# EAGLE design AgnusAdaptorv2 (EAGLE 9.6.2)
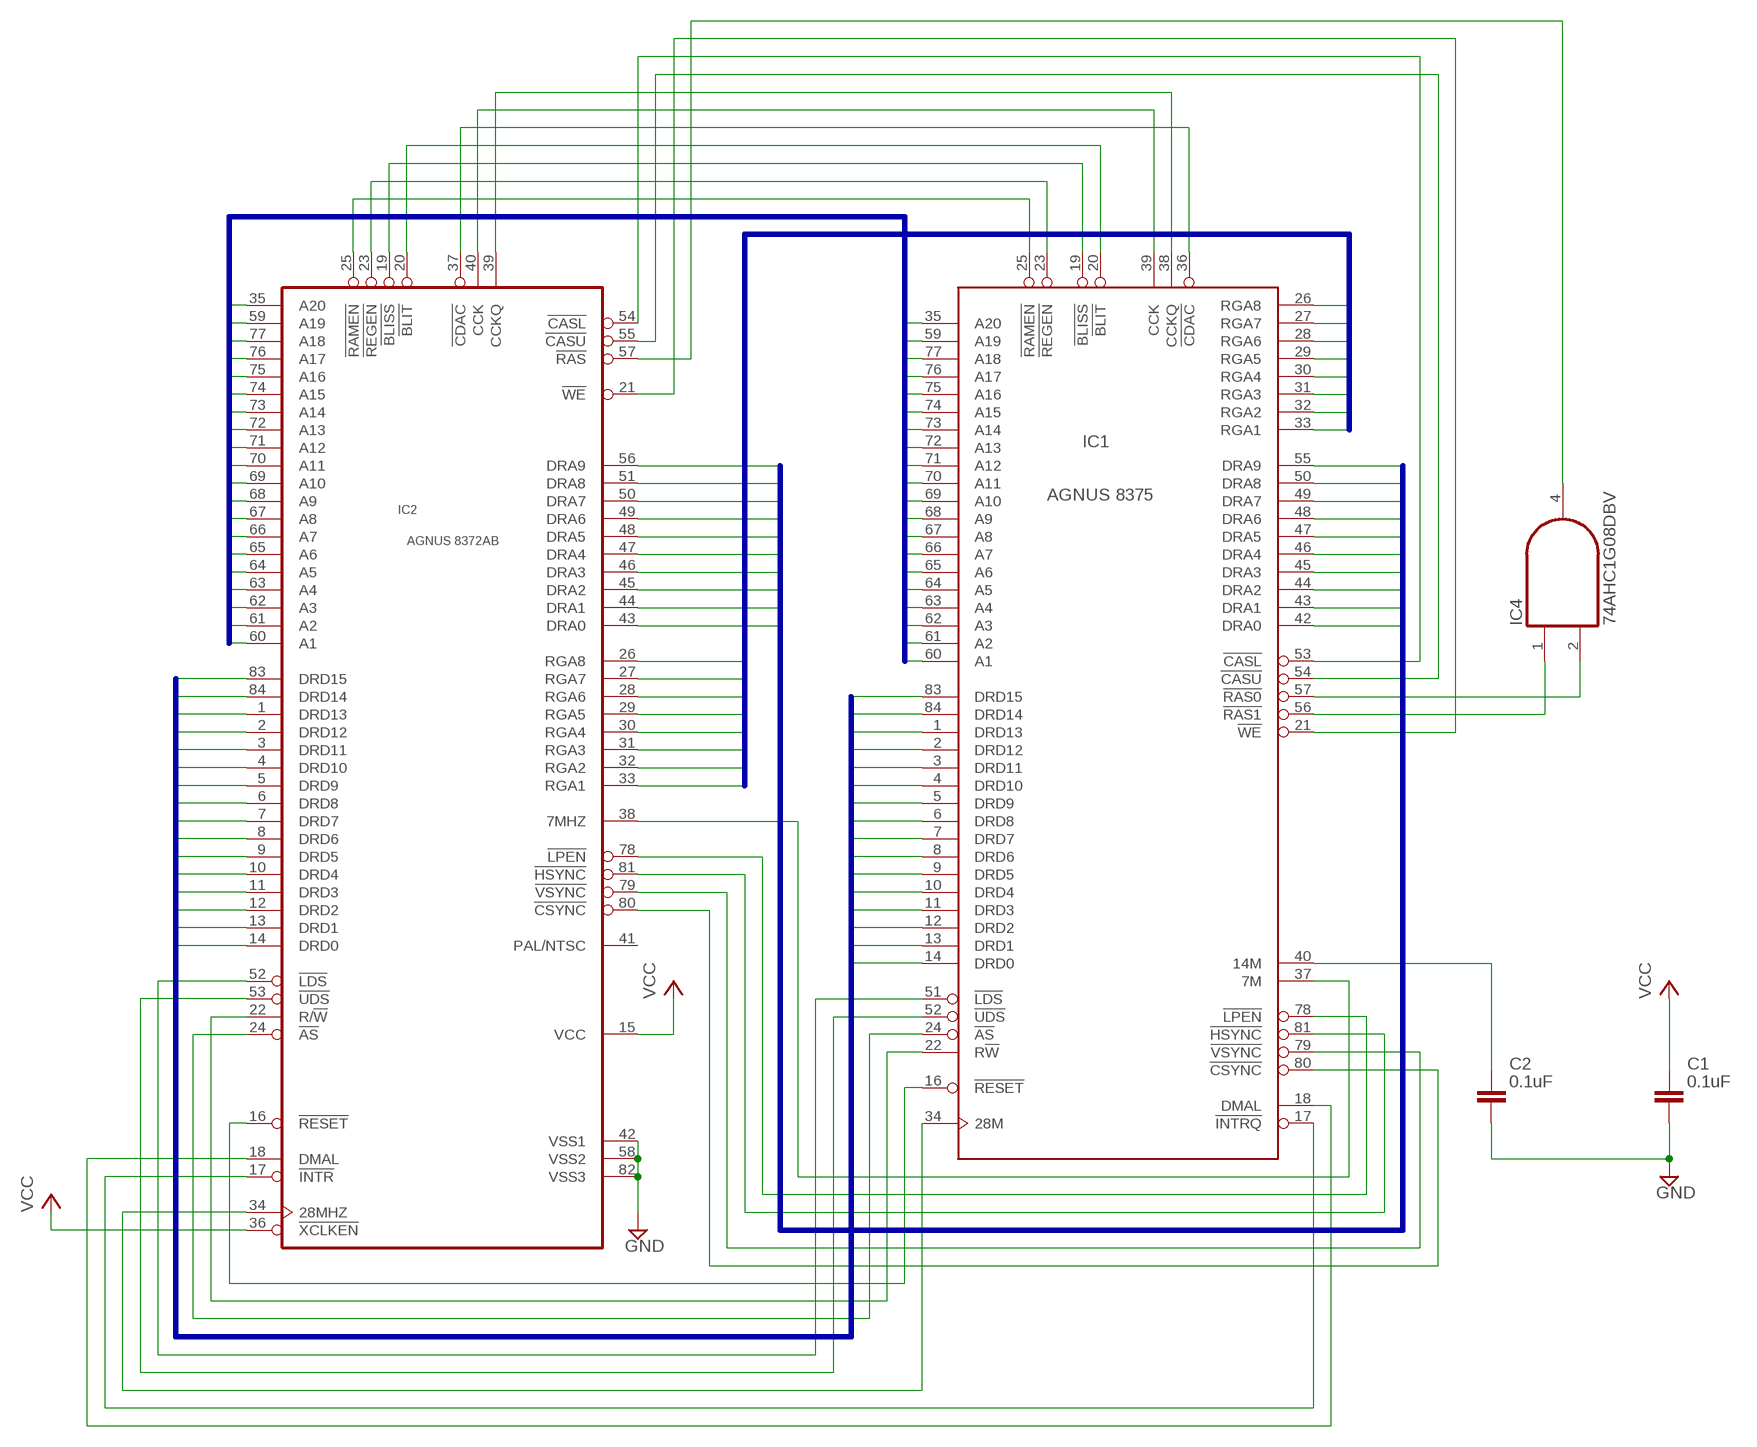
[diagram p0: schematic, sheet 1]

## Parts
C1  0.1uF  C_CHIP-0805(2012-METRIC)  [CAPC2012X110]
C2  0.1uF  C_CHIP-0805(2012-METRIC)  [CAPC2012X110]
IC1  AGNUS_8375_A500+_A600_THT  [PLCC84_T]
IC2  A3000 Agnus Socket  AGNUS_8372AB_THT_HDR  [PLCC84_T_H]
IC4  74AHC1G08DBV  [SOT23-5]

## Nets
7MHZ: IC1.37(7M) IC2.38(7MHZ)
28MHZ: IC1.34(28M) IC2.34(28MHZ)
!AS: IC1.24(!AS) IC2.24(!AS)
!BLISS: IC1.19(!BLISS) IC2.19(!BLISS)
!BLIT: IC1.20(!BLIT) IC2.20(!BLIT)
!CASL: IC1.53(!CASL) IC2.54(!CASL)
!CASU: IC1.54(!CASU) IC2.55(!CASU)
!CDAC: IC1.36(!CDAC) IC2.37(!CDAC)
!CSYNC: IC1.80(!CSYNC) IC2.80(!CSYNC)
!HSYNC: IC1.81(!HSYNC) IC2.81(!HSYNC)
!INTRQ: IC1.17(!INTRQ) IC2.17(!INTR)
!LDS: IC1.51(!LDS) IC2.52(!LDS)
!LPEN: IC1.78(!LPEN) IC2.78(!LPEN)
!RAMEN: IC1.25(!RAMEN) IC2.25(!RAMEN)
!RAS: IC2.57(!RAS) IC4.4(O)
!RAS0: IC1.57(!RAS0) IC4.2(I1)
!RAS1: IC1.56(!RAS1) IC4.1(I0)
!REGEN: IC1.23(!REGEN) IC2.23(!REGEN)
!RESET: IC1.16(!RESET) IC2.16(!RESET)
!UDS: IC1.52(!UDS) IC2.53(!UDS)
!VSYNC: IC1.79(!VSYNC) IC2.79(!VSYNC)
!WE: IC1.21(!WE) IC2.21(!WE)
A1: IC1.60(A1) IC2.60(A1)
A2: IC1.61(A2) IC2.61(A2)
A3: IC1.62(A3) IC2.62(A3)
A4: IC1.63(A4) IC2.63(A4)
A5: IC1.64(A5) IC2.64(A5)
A6: IC1.65(A6) IC2.65(A6)
A7: IC1.66(A7) IC2.66(A7)
A8: IC1.67(A8) IC2.67(A8)
A9: IC1.68(A9) IC2.68(A9)
A10: IC1.69(A10) IC2.69(A10)
A11: IC1.70(A11) IC2.70(A11)
A12: IC1.71(A12) IC2.71(A12)
A13: IC1.72(A13) IC2.72(A13)
A14: IC1.73(A14) IC2.73(A14)
A15: IC1.74(A15) IC2.74(A15)
A16: IC1.75(A16) IC2.75(A16)
A17: IC1.76(A17) IC2.76(A17)
A18: IC1.77(A18) IC2.77(A18)
A19: IC1.59(A19) IC2.59(A19)
A20: IC1.35(A20) IC2.35(A20)
CCK: IC1.39(CCK) IC2.40(CCK)
CCKQ: IC1.38(CCKQ) IC2.39(CCKQ)
DMAL: IC1.18(DMAL) IC2.18(DMAL)
DRA0: IC1.42(DRA0) IC2.43(DRA0)
DRA1: IC1.43(DRA1) IC2.44(DRA1)
DRA2: IC1.44(DRA2) IC2.45(DRA2)
DRA3: IC1.45(DRA3) IC2.46(DRA3)
DRA4: IC1.46(DRA4) IC2.47(DRA4)
DRA5: IC1.47(DRA5) IC2.48(DRA5)
DRA6: IC1.48(DRA6) IC2.49(DRA6)
DRA7: IC1.49(DRA7) IC2.50(DRA7)
DRA8: IC1.50(DRA8) IC2.51(DRA8)
DRA9: IC1.55(DRA9) IC2.56(DRA9)
DRD0: IC1.14(DRD0) IC2.14(DRD0)
DRD1: IC1.13(DRD1) IC2.13(DRD1)
DRD2: IC1.12(DRD2) IC2.12(DRD2)
DRD3: IC1.11(DRD3) IC2.11(DRD3)
DRD4: IC1.10(DRD4) IC2.10(DRD4)
DRD5: IC1.9(DRD5) IC2.9(DRD5)
DRD6: IC1.8(DRD6) IC2.8(DRD6)
DRD7: IC1.7(DRD7) IC2.7(DRD7)
DRD8: IC1.6(DRD8) IC2.6(DRD8)
DRD9: IC1.5(DRD9) IC2.5(DRD9)
DRD10: IC1.4(DRD10) IC2.4(DRD10)
DRD11: IC1.3(DRD11) IC2.3(DRD11)
DRD12: IC1.2(DRD12) IC2.2(DRD12)
DRD13: IC1.1(DRD13) IC2.1(DRD13)
DRD14: IC1.84(DRD14) IC2.84(DRD14)
DRD15: IC1.83(DRD15) IC2.83(DRD15)
GND: C1.2 C2.2 IC2.42(VSS1) IC2.58(VSS2) IC2.82(VSS3)
N$1: C2.1 IC1.40(14M)
R!W: IC1.22(R!W) IC2.22(R/!W!)
RGA1: IC1.33(RGA1) IC2.33(RGA1)
RGA2: IC1.32(RGA2) IC2.32(RGA2)
RGA3: IC1.31(RGA3) IC2.31(RGA3)
RGA4: IC1.30(RGA4) IC2.30(RGA4)
RGA5: IC1.29(RGA5) IC2.29(RGA5)
RGA6: IC1.28(RGA6) IC2.28(RGA6)
RGA7: IC1.27(RGA7) IC2.27(RGA7)
RGA8: IC1.26(RGA8) IC2.26(RGA8)
VCC [Vcc]: C1.1 IC2.15(VCC) IC2.36(!XCLKEN)
Unconnected: IC2.41(PAL/NTSC)

## Buses
A[1..20]
DRD[0..15]
RGA[1..8]
DRA[0..9]

## Power pins joined to a net without a drawn wire
GND: IC1.41(GND) IC1.58(GND) IC1.82(GND) IC4.3(GND)
VCC: IC1.15(VCC) IC4.5(VCC)

## Library data of the parts
C1 C2 = Capacitor:C: Capacitor - Generic; CATEGORY: Capacitor
IC1 = Amiga:AGNUS_8375_A500+_A600: 8375-(390344-0X)-AGNUS for A500+ and A600; SPICEPREFIX: X
IC2 = Amiga:AGNUS_8372AB: 8372AB AGNUS (318069-03x) for A3000(T)
IC4 = 74xx-little-us:74*1G08: 2-input AND gate

## Net classes
1 Vcc: width 0.406 mm

## Board
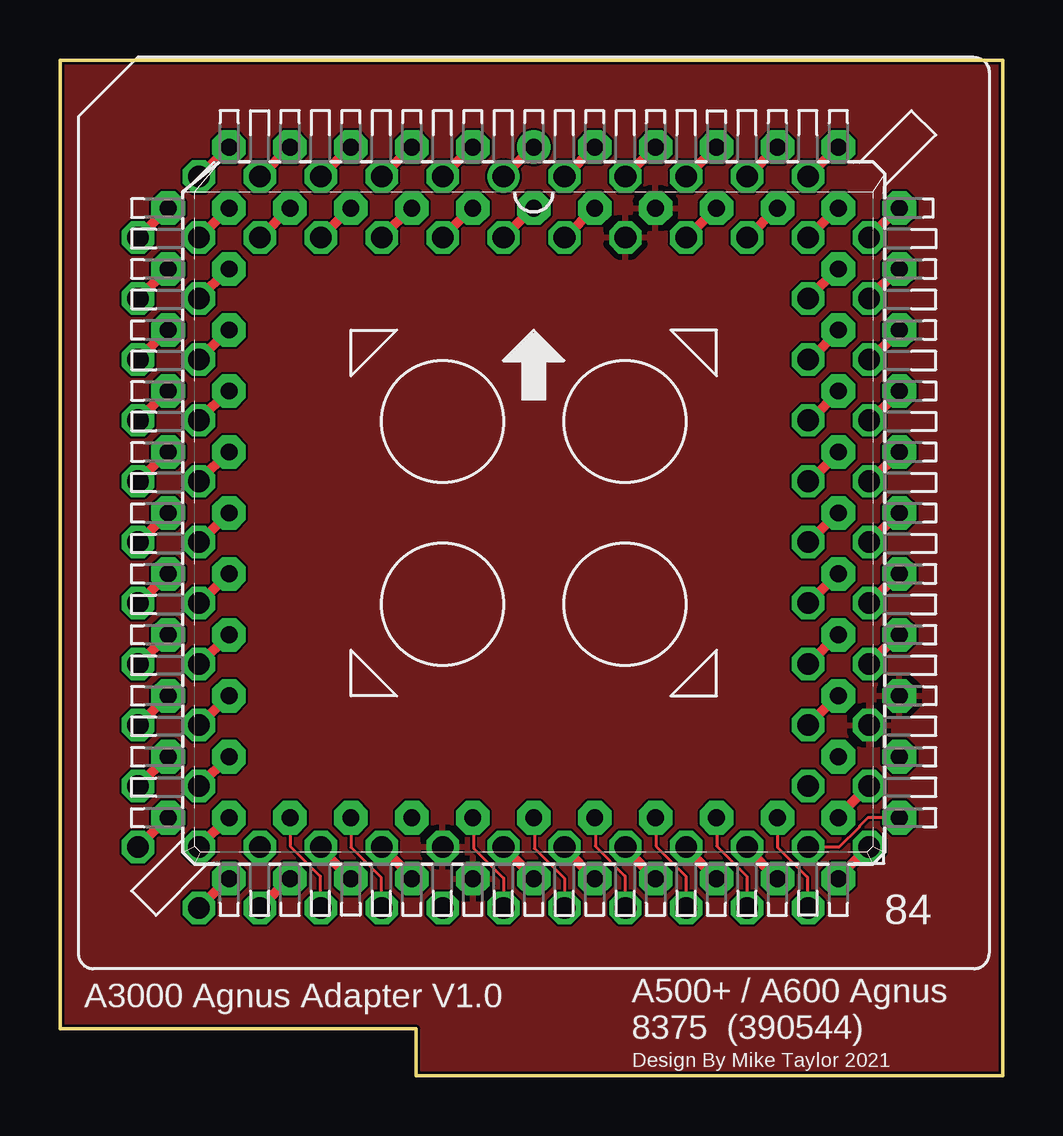
[diagram p1: board, top side]
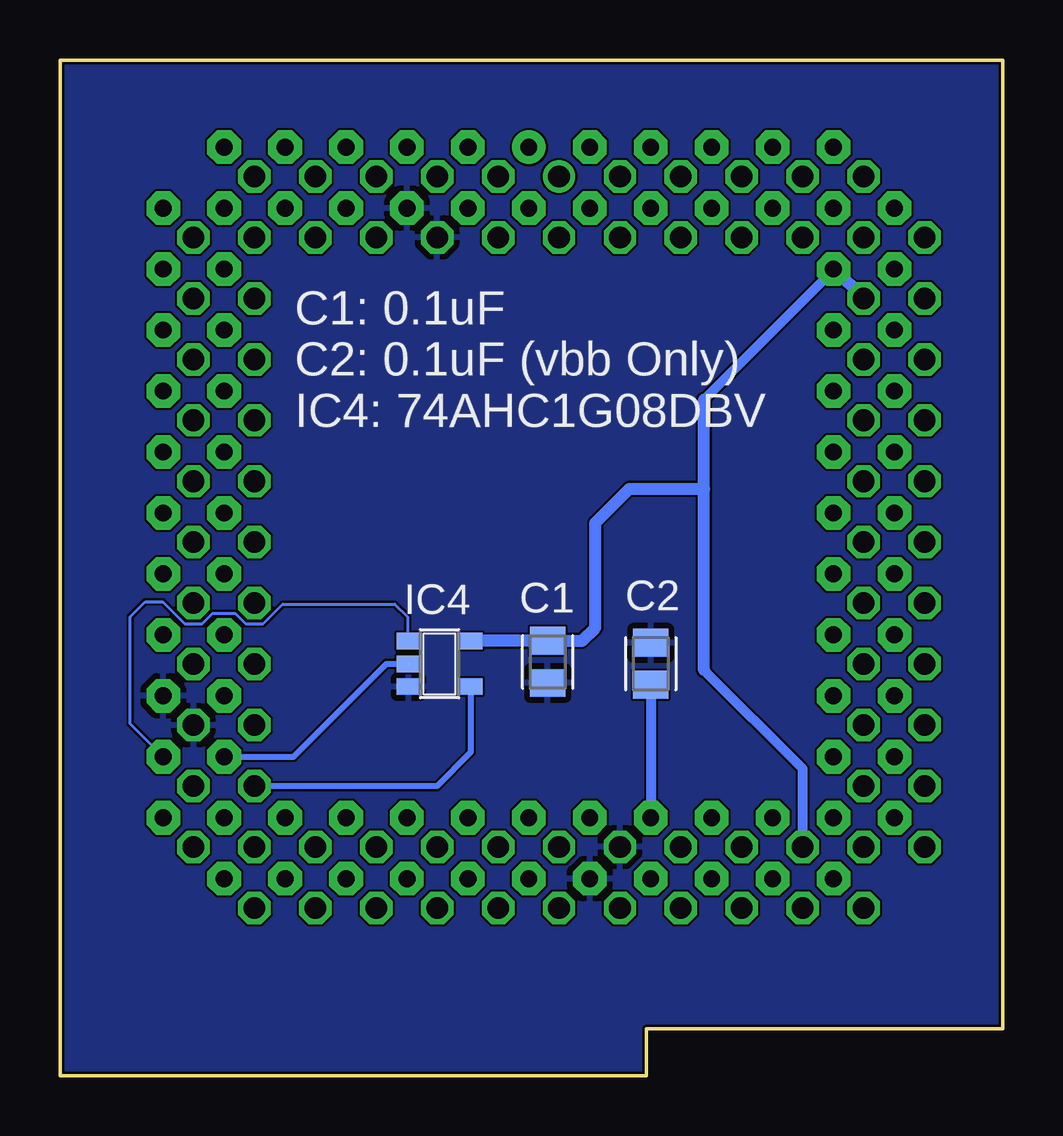
[diagram p2: board, bottom side, seen from below]

Size 39.29 x 42.32 mm. Coordinates in mm from the lower left corner, seen from the top.
Outline: 0,42.32 39.29,42.32 39.29,0 14.85,0 14.85,1.96 0,1.96 0,42.32
Copper layers (1*16): Top 0.035mm / dielectric 0.2mm / Bottom 0.035mm
Design rules "jlcpcb-2-layer *": minimum track width 3.5mil, minimum drill 0.2mm, track to track 3.5mil, track to pad 5mil, pad to pad 5mil, via to via 5mil, smd to smd 0mil, copper to edge 0.1mm, drill to drill 5mil, minimum pad ring 4mil, minimum via ring 4mil, stop-mask expansion 3mil, vias tented up to drill 100mil, thermal gap 10mil

### Footprints (pad centres in the part's own frame; a part is rotated, then mirrored left to right if it is on the bottom)
CAPC2012X110 = smd 1.165 x 1.465: 1 -0.875,0; 2 0.875,0
PLCC84_T = drill 0.7 pad 1.4: 1 0,15.24 | drill 0.7 pad 1.4 octagon: 2 0,12.7; 3 -2.54,15.24; 4 -2.54,12.7; 5 -5.08,15.24; 6 -5.08,12.7; 7 -7.62,15.24; 8 -7.62,12.7; 9 -10.16,15.24; 10 -10.16,12.7; 11 -12.7,15.24; 12 -15.24,12.7; 13 -12.7,12.7; 14 -15.24,10.16; 15 -12.7,10.16; 16 -15.24,7.62; 17 -12.7,7.62; 18 -15.24,5.08; 19 -12.7,5.08; 20 -15.24,2.54; 21 -12.7,2.54; 22 -15.24,0; 23 -12.7,0; 24 -15.24,-2.54; 25 -12.7,-2.54; 26 -15.24,-5.08; 27 -12.7,-5.08; 28 -15.24,-7.62; 29 -12.7,-7.62; 30 -15.24,-10.16; 31 -12.7,-10.16; 32 -15.24,-12.7; 33 -12.7,-15.24; 34 -12.7,-12.7; 35 -10.16,-15.24; 36 -10.16,-12.7; 37 -7.62,-15.24; 38 -7.62,-12.7; 39 -5.08,-15.24; 40 -5.08,-12.7; 41 -2.54,-15.24; 42 -2.54,-12.7; 43 0,-15.24; 44 0,-12.7; 45 2.54,-15.24; 46 2.54,-12.7; 47 5.08,-15.24; 48 5.08,-12.7; 49 7.62,-15.24; 50 7.62,-12.7; 51 10.16,-15.24; 52 10.16,-12.7; 53 12.7,-15.24; 54 15.24,-12.7; 55 12.7,-12.7; 56 15.24,-10.16; 57 12.7,-10.16; 58 15.24,-7.62; 59 12.7,-7.62; 60 15.24,-5.08; 61 12.7,-5.08; 62 15.24,-2.54; 63 12.7,-2.54; 64 15.24,0; 65 12.7,0; 66 15.24,2.54; 67 12.7,2.54; 68 15.24,5.08; 69 12.7,5.08; 70 15.24,7.62; 71 12.7,7.62; 72 15.24,10.16; 73 12.7,10.16; 74 15.24,12.7; 75 12.7,15.24; 76 12.7,12.7; 77 10.16,15.24; 78 10.16,12.7; 79 7.62,15.24; 80 7.62,12.7; 81 5.08,15.24; 82 5.08,12.7; 83 2.54,15.24; 84 2.54,12.7
PLCC84_T_H = drill 0.9: 1 -1.27,15.24 | drill 0.9 octagon: 2 -1.27,12.7; 3 -3.81,15.24; 4 -3.81,12.7; 5 -6.35,15.24; 6 -6.35,12.7; 7 -8.89,15.24; 8 -8.89,12.7; 9 -11.43,15.24; 10 -11.43,12.7; 11 -13.97,15.24; 12 -16.51,12.7; 13 -13.97,12.7; 14 -16.51,10.16; 15 -13.97,10.16; 16 -16.51,7.62; 17 -13.97,7.62; 18 -16.51,5.08; 19 -13.97,5.08; 20 -16.51,2.54; 21 -13.97,2.54; 22 -16.51,0; 23 -13.97,0; 24 -16.51,-2.54; 25 -13.97,-2.54; 26 -16.51,-5.08; 27 -13.97,-5.08; 28 -16.51,-7.62; 29 -13.97,-7.62; 30 -16.51,-10.16; 31 -13.97,-10.16; 32 -16.51,-12.7; 33 -13.97,-15.24; 34 -13.97,-12.7; 35 -11.43,-15.24; 36 -11.43,-12.7; 37 -8.89,-15.24; 38 -8.89,-12.7; 39 -6.35,-15.24; 40 -6.35,-12.7; 41 -3.81,-15.24; 42 -3.81,-12.7; 43 -1.27,-15.24; 44 -1.27,-12.7; 45 1.27,-15.24; 46 1.27,-12.7; 47 3.81,-15.24; 48 3.81,-12.7; 49 6.35,-15.24; 50 6.35,-12.7; 51 8.89,-15.24; 52 8.89,-12.7; 53 11.43,-15.24; 54 13.97,-12.7; 55 11.43,-12.7; 56 13.97,-10.16; 57 11.43,-10.16; 58 13.97,-7.62; 59 11.43,-7.62; 60 13.97,-5.08; 61 11.43,-5.08; 62 13.97,-2.54; 63 11.43,-2.54; 64 13.97,0; 65 11.43,0; 66 13.97,2.54; 67 11.43,2.54; 68 13.97,5.08; 69 11.43,5.08; 70 13.97,7.62; 71 11.43,7.62; 72 13.97,10.16; 73 11.43,10.16; 74 13.97,12.7; 75 11.43,15.24; 76 11.43,12.7; 77 8.89,15.24; 78 8.89,12.7; 79 6.35,15.24; 80 6.35,12.7; 81 3.81,15.24; 82 3.81,12.7; 83 1.27,15.24; 84 1.27,12.7
SOT23-5 = smd 0.69 x 0.99: 1 -0.95,-1.29; 2 0,-1.29; 3 0.95,-1.29; 4 0.95,1.3; 5 -0.95,1.3

### Placement (x,y rotation side)
C1  18.96,17.23 270 bottom
C2  14.67,17.16 90 bottom
IC1  19.75,23.44 0 top
IC2  19.76,22.23 0 top
IC4  23.47,17.16 270 bottom

### Tracks (layer width: path | path; a pad name or v marks a point on that pad's centre or on a via)
7MHZ
  Top 0.089: 10.89,9.42 10.89,9.51 IC2.38 | 12.09,8.22 IC1.37
  Top 0.406: 12.09,8.22 10.89,9.42
28MHZ
  Top 0.089: 7.02,10.76 IC1.34
  Top 0.406: 7.02,10.76 IC2.34
!AS
  Top 0.089: 3.29,19.69 IC2.24 | 4.49,20.89 IC1.24
  Top 0.406: 4.49,20.89 3.29,19.69
!BLISS
  Top 0.089: 7.02,28.54 IC1.19
  Top 0.406: 7.02,28.54 IC2.19
!BLIT
  Top 0.089: 4.49,26 IC1.20
  Top 0.406: 4.49,26 IC2.20
!CASL
  Top 0.089: IC1.53 32.45,8.27 | 33.69,9.51 IC2.54
  Top 0.406: 32.45,8.27 33.69,9.51
!CASU
  Top 0.127: IC2.55 32.49,9.52 33.34,10.38 33.34,10.4 33.69,10.76 34.98,10.76 IC1.54
!CDAC
  Top 0.089: 10.85,7.02 IC2.37 | 9.6,10.71 IC1.36
  Top 0.127: 10.85,7.02 10.85,8.31 9.6,9.56 9.6,10.71
!CSYNC
  Top 0.089: 26.14,34.94 IC2.80 | 27.34,36.14 IC1.80
  Top 0.406: 27.34,36.14 26.14,34.94
!HSYNC
  Top 0.089: 23.6,37.47 IC2.81 | 24.8,38.67 IC1.81
  Top 0.406: 24.8,38.67 23.6,37.47
!INTRQ
  Top 0.089: 5.82,29.87 IC2.17 | 7.02,31.07 IC1.17
  Top 0.406: 7.02,31.07 5.82,29.87
!LDS
  Top 0.089: 28.67,9.42 28.67,9.51 IC2.52 | 29.87,8.22 IC1.51
  Top 0.406: 29.87,8.22 28.67,9.42
!LPEN
  Top 0.089: 28.67,34.94 IC2.78 | 29.87,36.14 IC1.78
  Top 0.406: 29.87,36.14 28.67,34.94
!RAMEN
  Top 0.089: 5.82,19.69 IC2.25 | 7.02,20.89 IC1.25
  Top 0.406: 7.02,20.89 5.82,19.69
!RAS
  Bottom 0.254: IC4.4 22.17,13.48 23.58,12.07 IC2.57
!RAS0
  Bottom 0.254: IC1.57 29.56,13.28 25.69,17.16 IC4.2
!RAS1
  Bottom 0.127: IC1.56 36.36,14.66 36.36,19.11 35.74,19.74 35.01,19.74 34.09,18.82 33.37,18.82 32.94,19.26 31.98,19.26 31.55,18.82 30.83,18.82 30.01,19.65 25.34,19.65 24.8,19.11 24.8,18.15 IC4.1
!REGEN
  Top 0.089: 5.82,22.23 IC2.23 | 7.02,23.43 IC1.23
  Top 0.406: 7.02,23.43 5.82,22.23
!RESET
  Top 0.089: 3.29,29.87 IC2.16 | 4.49,31.07 IC1.16
  Top 0.406: 4.49,31.07 3.29,29.87
!UDS
  Top 0.089: 31.16,7.02 IC2.53 | 29.91,10.71 IC1.52
  Top 0.127: 31.16,7.02 31.16,8.27 29.91,9.51 29.91,10.71
!VSYNC
  Top 0.089: 26.14,37.47 IC2.79 | 27.34,38.67 IC1.79
  Top 0.406: 27.34,38.67 26.14,37.47
!WE
  Top 0.089: 5.82,24.8 IC2.21 | 7.02,26 IC1.21
  Top 0.406: 7.02,26 5.82,24.8
A1
  Top 0.089: 33.74,17.16 IC2.60 | 34.98,18.4 IC1.60
  Top 0.406: 34.98,18.4 33.74,17.16
A2
  Top 0.089: 32.45,18.4 IC1.61
  Top 0.406: 32.45,18.4 IC2.61
A3
  Top 0.089: 34.98,20.94 IC1.62
  Top 0.406: 34.98,20.94 IC2.62
A4
  Top 0.089: IC2.63 | 32.45,20.94 IC1.63
  Top 0.406: 32.45,20.94 IC2.63
A5
  Top 0.089: IC2.64 | 34.98,23.47 IC1.64
  Top 0.406: 34.98,23.47 IC2.64
A6
  Top 0.089: IC2.65 | 32.45,23.47 IC1.65
  Top 0.406: 32.45,23.47 IC2.65
A7
  Top 0.089: 33.83,24.8 33.74,24.8 IC2.66 | 34.98,25.96 IC1.66
  Top 0.406: 34.98,25.96 33.83,24.8
A8
  Top 0.089: 31.29,24.8 31.2,24.8 IC2.67 | 32.45,25.96 IC1.67
  Top 0.406: 32.45,25.96 31.29,24.8
A9
  Top 0.089: 33.83,27.34 33.74,27.34 IC2.68 | 34.98,28.49 IC1.68
  Top 0.406: 34.98,28.49 33.83,27.34
A10
  Top 0.089: 31.29,27.34 31.2,27.34 IC2.69 | 32.45,28.49 IC1.69
  Top 0.406: 32.45,28.49 31.29,27.34
A11
  Top 0.089: 33.83,29.87 33.74,29.87 IC2.70 | 34.98,31.03 IC1.70
  Top 0.406: 34.98,31.03 33.83,29.87
A12
  Top 0.089: 31.29,29.87 31.2,29.87 IC2.71 | 32.45,31.03 IC1.71
  Top 0.406: 32.45,31.03 31.29,29.87
A13
  Top 0.089: IC1.72 34.94,33.6 | 33.74,32.4 IC2.72
  Top 0.406: 34.94,33.6 33.74,32.4
A14
  Top 0.089: IC1.73 32.4,33.6 | 31.2,32.4 IC2.73
  Top 0.406: 32.4,33.6 31.2,32.4
A15
  Top 0.089: 33.74,34.94 IC2.74 | 34.98,36.18 IC1.74
  Top 0.406: 34.98,36.18 33.74,34.94
A16
  Top 0.089: IC2.75 | 32.45,38.72 IC1.75
  Top 0.406: 32.45,38.72 IC2.75
A17
  Top 0.089: 32.45,36.18 IC1.76
  Top 0.406: 32.45,36.18 IC2.76
A18
  Top 0.089: 28.67,37.47 IC2.77 | 29.87,38.67 IC1.77
  Top 0.406: 29.87,38.67 28.67,37.47
A19
  Top 0.089: IC1.59 32.4,15.82 | 31.2,14.62 IC2.59
  Top 0.406: 32.4,15.82 31.2,14.62
A20
  Top 0.089: 8.36,7.02 IC2.35 | 9.56,8.22 IC1.35
  Top 0.406: 9.56,8.22 8.36,7.02
CCK
  Top 0.089: IC1.39 14.67,8.27
  Top 0.406: 14.67,8.27 IC2.40
CCKQ
  Top 0.089: 13.38,7.02 IC2.39 | 12.13,10.71 IC1.38
  Top 0.127: 13.38,7.02 13.38,8.27 12.13,9.51 12.13,10.71
DMAL
  Top 0.089: 3.29,27.34 IC2.18 | 4.49,28.54 IC1.18
  Top 0.406: 4.49,28.54 3.29,27.34
DRA0
  Top 0.089: 17.25,10.71 IC1.42
  Top 0.127: IC2.43 18.49,8.22 17.25,9.47 17.25,10.71
DRA1
  Top 0.089: IC2.44 | 19.78,8.22 IC1.43
  Top 0.406: 19.78,8.22 IC2.44
DRA2
  Top 0.089: 21.02,7.02 IC2.45 | 19.78,10.71 IC1.44
  Top 0.127: 21.02,7.02 21.02,8.22 19.78,9.47 19.78,10.71
DRA3
  Top 0.089: 21.07,9.42 21.07,9.51 IC2.46
  Top 0.406: IC1.45 21.07,9.42
DRA4
  Top 0.089: 23.56,7.02 IC2.47 | 22.31,10.71 IC1.46
  Top 0.127: 23.56,7.02 23.56,8.31 22.31,9.56 22.31,10.71
DRA5
  Top 0.089: 23.6,9.42 23.6,9.51 IC2.48 | 24.8,8.22 IC1.47
  Top 0.406: 24.8,8.22 23.6,9.42
DRA6
  Top 0.089: 26.09,7.02 IC2.49 | 24.85,10.71 IC1.48
  Top 0.127: 26.09,7.02 26.09,8.31 24.85,9.56 24.85,10.71
DRA7
  Top 0.089: 26.14,9.42 26.14,9.51 IC2.50 | 27.34,8.22 IC1.49
  Top 0.406: 27.34,8.22 26.14,9.42
DRA8
  Top 0.089: 28.63,7.02 IC2.51 | 27.38,10.71 IC1.50
  Top 0.127: 28.63,7.02 28.63,8.31 27.38,9.56 27.38,10.71
DRA9
  Top 0.089: IC1.55 32.45,10.8 | 33.69,12.05 IC2.56
  Top 0.406: 32.45,10.8 33.69,12.05
DRD0
  Top 0.089: 3.29,32.4 IC2.14 | 4.49,33.6 IC1.14
  Top 0.406: 4.49,33.6 3.29,32.4
DRD1
  Top 0.089: 5.82,34.94 IC2.13 | 7.02,36.14 IC1.13
  Top 0.406: 7.02,36.14 5.82,34.94
DRD2
  Top 0.089: 3.29,34.94 IC2.12 | 4.49,36.14 IC1.12
  Top 0.406: 4.49,36.14 3.29,34.94
DRD3
  Top 0.089: 5.82,37.47 IC2.11 | 7.02,38.67 IC1.11
  Top 0.406: 7.02,38.67 5.82,37.47
DRD4
  Top 0.089: 8.36,34.94 IC2.10 | 9.56,36.14 IC1.10
  Top 0.406: 9.56,36.14 8.36,34.94
DRD5
  Top 0.089: 8.36,37.47 IC2.9 | 9.56,38.67 IC1.9
  Top 0.406: 9.56,38.67 8.36,37.47
DRD6
  Top 0.089: 10.89,34.94 IC2.8 | 12.09,36.14 IC1.8
  Top 0.406: 12.09,36.14 10.89,34.94
DRD7
  Top 0.089: 10.89,37.47 IC2.7 | 12.09,38.67 IC1.7
  Top 0.406: 12.09,38.67 10.89,37.47
DRD8
  Top 0.089: 14.67,36.18 IC1.6
  Top 0.406: 14.67,36.18 IC2.6
DRD9
  Top 0.089: IC2.5 | 14.67,38.72 IC1.5
  Top 0.406: 14.67,38.72 IC2.5
DRD10
  Top 0.089: 15.96,34.94 IC2.4 | 17.2,36.18 IC1.4
  Top 0.406: 17.2,36.18 15.96,34.94
DRD11
  Top 0.089: 17.2,38.72 IC1.3
  Top 0.406: 17.2,38.72 IC2.3
DRD12
  Top 0.089: 18.49,34.94 IC2.2 | 19.74,36.18 IC1.2
  Top 0.406: 19.74,36.18 18.49,34.94
DRD13
  Top 0.089: IC2.1 | 19.74,38.72 IC1.1
  Top 0.406: 19.74,38.72 IC2.1
DRD14
  Top 0.089: 21.07,34.94 IC2.84 | 22.27,36.14 IC1.84
  Top 0.406: 22.27,36.14 21.07,34.94
DRD15
  Top 0.089: 21.07,37.47 IC2.83 | 22.27,38.67 IC1.83
  Top 0.406: 22.27,38.67 21.07,37.47
GND
  pour Top: 0.19,42.15 0.19,0.19 39.15,0.19 39.15,42.15
  pour Bottom: 0.19,42.15 39.15,42.15 39.15,0.19 0.19,0.19
N$1
  Bottom 0.406: C2.1 IC1.40
R!W
  Top 0.089: 3.29,22.23 IC2.22
  Top 0.406: IC1.22 3.29,22.23
RGA1
  Top 0.089: 5.82,7.02 IC2.33 | 7.02,8.22 IC1.33
  Top 0.406: 7.02,8.22 5.82,7.02
RGA2
  Top 0.089: 3.29,9.56 IC2.32 | 4.49,10.76 IC1.32
  Top 0.406: 4.49,10.76 3.29,9.56
RGA3
  Top 0.089: 5.82,12.09 IC2.31 | 7.02,13.29 IC1.31
  Top 0.406: 7.02,13.29 5.82,12.09
RGA4
  Top 0.089: 3.29,12.09 IC2.30 | 4.49,13.29 IC1.30
  Top 0.406: 4.49,13.29 3.29,12.09
RGA5
  Top 0.089: 5.82,14.62 IC2.29 | 7.02,15.82 IC1.29
  Top 0.406: 7.02,15.82 5.82,14.62
RGA6
  Top 0.089: 3.29,14.62 IC2.28 | 4.49,15.82 IC1.28
  Top 0.406: 4.49,15.82 3.29,14.62
RGA7
  Top 0.089: 5.82,17.16 IC2.27 | 7.02,18.36 IC1.27
  Top 0.406: 7.02,18.36 5.82,17.16
RGA8
  Top 0.089: 3.29,17.16 IC2.26 | 4.49,18.36 IC1.26
  Top 0.406: 4.49,18.36 3.29,17.16
VCC
  Top 0.406: IC2.15 7.01,33.6 IC1.15
  Bottom 0.406: IC4.5 | IC1.15 7.01,33.6 12.45,28.17 | IC2.36 8.33,12.78 12.45,16.89
  Bottom 0.508: IC4.5 C1.1 17.54,18.11 16.98,18.67 16.98,23.02 15.56,24.45 12.45,24.45 | IC2.15 7.01,33.6 | 12.45,16.89 12.45,24.45 | 12.45,24.45 12.45,28.17

### Text on the board
tNames: A3000 Agnus Adapter V1.0 | A500+ / A600 Agnus / 8375 (390544) | Design By Mike Taylor 2021
bNames: C1: 0.1uF / C2: 0.1uF (vbb Only) / IC4: 74AHC1G08DBV